# EAGLE design TPS55340-testBoard (EAGLE 9.6.2)
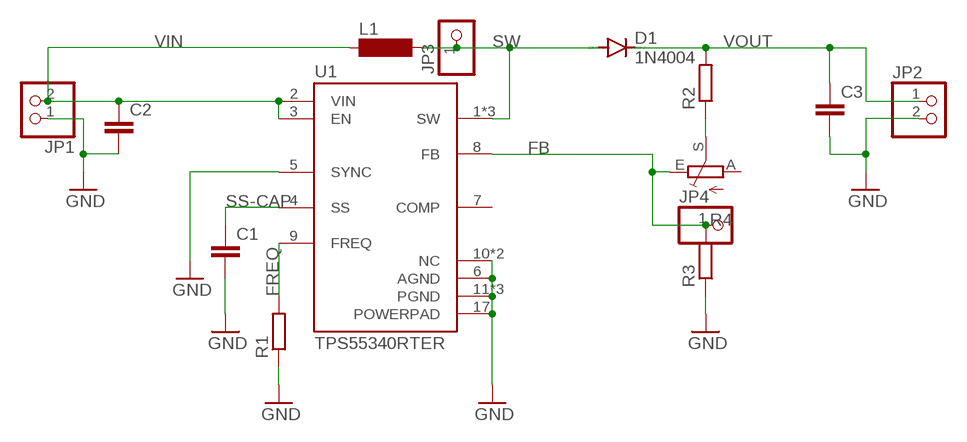
[diagram p0: schematic, sheet 1]

## Parts
C1  C5/5  [C5B5]
C2  C5/5  [C5B5]
C3  C5/5  [C5B5]
D1  1N4004  [DO41-10]
JP1  PINHD-1X2/90  [1X02/90]
JP2  PINHD-1X2/90  [1X02/90]
JP3  PINHD-1X1  [1X01]
JP4  PINHD-1X1  [1X01]
L1  BS75  [BS75]
R1  R-EU_VMTB60  [VMTB60]
R2  R-EU_VMTB60  [VMTB60]
R3  R-EU_VMTB60  [VMTB60]
R4  TRIM_EU-CA9V  [CA9V]
U1  TPS55340RTER  [QFN50P300X300X80-17N]

## Nets
FB: JP4.1 R3.2 R4.E U1.8(FB)
FREQ: R1.2 U1.9(FREQ)
GND: C1.2 C2.2 C3.2 JP1.1 JP2.2 R1.1 R3.1 U1.5(SYNC) U1.6(AGND) U1.10(NC) U1.11(PGND) U1.12(PGND) U1.13(PGND) U1.14(NC) U1.17(POWERPAD)
N$1: R2.1 R4.S
SS-CAP: C1.1 U1.4(SS)
SW: D1.A JP3.1 L1.2 U1.1(SW) U1.15(SW) U1.16(SW)
VIN: C2.1 JP1.2 L1.1 U1.2(VIN) U1.3(EN)
VOUT: C3.1 D1.C JP2.1 R2.2
Unconnected: R4.A U1.7(COMP)

## Library data of the parts
C1-C3 = capacitor-wima:C: CAPACITOR naming: grid - package width
D1 = diode:1N4004: DIODE general purpose rectifier, 1 A
JP1 JP2 = pinhead:PINHD-1X2: PIN HEADER
JP3 JP4 = pinhead:PINHD-1X1: PIN HEADER
L1 = inductor-neosid:BS: INDUCTOR nominal inductance, magnetically screened; OC_FARNELL: unknown; OC_NEWARK: unknown
R1-R3 = rcl:R-EU_: RESISTOR, European symbol; SPICEPREFIX: R
R4 = pot:TRIM_EU-: POTENTIOMETER
U1 = TPS55340RTER:TPS55340RTER: Integrated, 5-A 40-V Wide Input Range Boost/SEPIC/Flyback DC-DC Regulator 16-WQFN -40 to 150 Check availability <https://pricing.snapeda.com/parts/TPS55340RTER/Texas%20Instruments/view-part?ref=eda>; AVAILABILITY: In Stock; DESCRIPTION: 5-A, 40-V, wide VIN boost, flyback, & SEPIC converter; MF: Texas Instruments; MP: TPS55340RTER; PACKAGE: WQFN-16 Texas Instruments; PRICE: None; PURCHASE-URL: https://pricing.snapeda.com/search/part/TPS55340RTER/?ref=eda

## Board
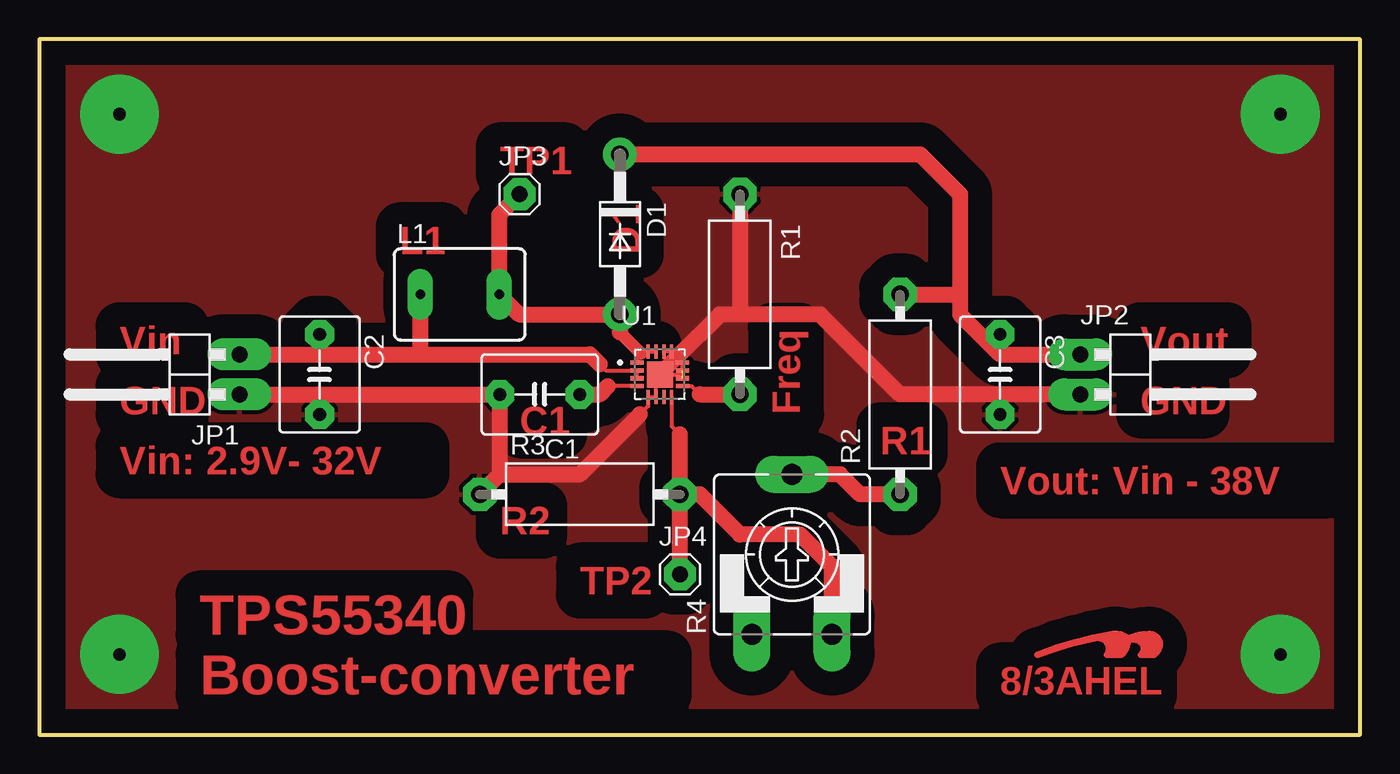
[diagram p1: board, top side]

Size 83.8 x 44.12 mm. Coordinates in mm from the lower left corner, seen from the top.
Outline: 0,0 83.8,0 83.8,44.12 0,44.12 0,0
Copper layers (1*16): Top 0.035mm / dielectric 1.5mm / Bottom 0.035mm
Design rules "default *": minimum track width 6mil, minimum drill 0.35mm, track to track 6mil, track to pad 6mil, pad to pad 6mil, via to via 6mil, smd to smd 6mil, copper to edge 40mil, drill to drill 6mil, minimum pad ring 20mil, minimum via ring 16mil, stop-mask expansion 4mil, vias tented up to drill 0mil, thermal gap 10mil

### Footprints (pad centres in the part's own frame; a part is rotated, then mirrored left to right if it is on the bottom)
C5B5 = drill 0.813 pad 1.6 octagon: 1 -2.54,0; 2 2.54,0
DO41-10 = drill 1.118: A 5.08,0; C -5.08,0
1X02/90 = drill 1.016 long: 1 -1.27,-3.81; 2 1.27,-3.81
1X01 = drill 1.016 octagon: 1 0,0
BS75 = drill 0.6 long: 1 -2.5,0; 2 2.5,0
VMTB60 = drill 1.1 octagon: 1 -6.35,0; 2 6.35,0
CA9V = drill 1.321 long: A -2.54,-5.08; E 2.54,-5.08; S 0,5.08
QFN50P300X300X80-17N = smd 0.89 x 0.26: 1 -1.44,0.75; 2 -1.44,0.25; 3 -1.44,-0.25; 4 -1.44,-0.75; 9 1.44,-0.75; 10 1.44,-0.25; 11 1.44,0.25; 12 1.44,0.75 | smd 0.26 x 0.89: 5 -0.75,-1.44; 6 -0.25,-1.44; 7 0.25,-1.44; 8 0.75,-1.44; 13 0.75,1.44; 14 0.25,1.44; 15 -0.25,1.44; 16 -0.75,1.44 | smd 1.66 x 1.66: 17 0,0

### Placement (x,y rotation side)
C1  31.75,21.59 180 top
C2  17.78,22.86 270 top
C3  60.96,22.86 270 top
D1  36.83,31.75 270 top
JP1  8.89,22.86 90 top
JP2  69.85,22.86 270 top
JP3  30.48,34.29 0 top
JP4  40.64,10.16 0 top
L1  26.67,27.94 0 top
R1  44.45,27.94 270 top
R2  54.61,21.59 90 top
R3  34.29,15.24 0 top
R4  47.75,11.43 0 top
U1  39.37,22.86 0 top
U$1  [LOGOTOP_8]  68.58,5.08 0 top

### Tracks (layer width: path | path; a pad name or v marks a point on that pad's centre or on a via)
FB
  Top 0.254: 40.64,19.05 40.12,19.57 U1.8
  Top 1.016: R3.2 40.64,19.05 | JP4.1 R3.2 | R4.E 50.29,10.67 48.26,12.7 44.45,12.7 41.91,15.24 R3.2
FREQ
  Top 0.254: U1.9 41.39,22.11 41.91,21.59
  Top 1.016: 41.91,21.59 R1.2
GND  (via drill 0.8 pad 5)  (1 unrouted)
  Top 0.254: U1.10 40.81,22.86 | 40.81,22.86 U1.12 40.47,23.95 U1.13 U1.14 | 40.81,22.86 U1.17 39.12,22.61 U1.6 U1.5 38.62,20.84 38.1,20.32
  Top 1.016: 29.21,16.51 C1.2 17.78,21.59 | 29.21,16.51 R3.1 | JP1.1 17.78,21.59 | 29.21,16.51 34.29,16.51 38.1,20.32 | JP2.2 60.96,21.59 | 60.96,21.59 54.61,21.59 49.53,26.67 44.45,26.67 | 44.45,26.67 43.18,26.67 40.47,23.95 U1.17 | R1.1 44.45,26.67 | C2.2 17.78,21.59 | C3.2 60.96,21.59
  other vias: 5.08,39.37 5.08,5.08 78.74,5.08 78.74,39.37
  pour Top (isolate 1.524): 0,44.45 83.82,44.45 83.82,0 0,0
N$1
  Top 1.016: R2.1 52.07,15.24 50.8,16.51 R4.S
SS-CAP
  Top 0.254: U1.4 36.08,22.11
  Top 1.016: C1.1 35.56,21.59 36.08,22.11
SW
  Top 0.254: U1.1 37.93,23.96 38.16,24.19 38.27,24.3 U1.16 U1.15
  Top 0.813: 36.83,25.53 38.16,24.19
  Top 1.016: 36.83,25.53 D1.A 30.44,26.67 L1.2 29.17,32.98 JP3.1
VIN
  Top 0.254: 35.56,23.49 35.95,23.11 U1.2 U1.3
  Top 0.813: 24.17,24.17 24.13,24.13
  Top 1.016: JP1.2 17.78,24.13 | 17.78,24.13 24.13,24.13 34.92,24.13 35.56,23.49 | L1.1 24.17,24.17 | C2.1 17.78,24.13
VOUT
  Top 1.016: D1.C 55.88,36.83 58.42,34.29 58.42,27.94 | 58.42,27.94 58.42,26.67 60.96,24.13 | 60.96,24.13 JP2.1 | R2.2 58.42,27.94 | C3.1 60.96,24.13

### Text on the board
Top: TP1 | L1 | D1 | Vin | Vout | GND | Freq | GND | C1 | R1 | Vin: 2.9V- 32V | Vout: Vin - 38V | R2 | TP2 | TPS55340 | Boost-converter | 8/3AHEL